# EAGLE design OperantFEDv5 (EAGLE 7.7.0)
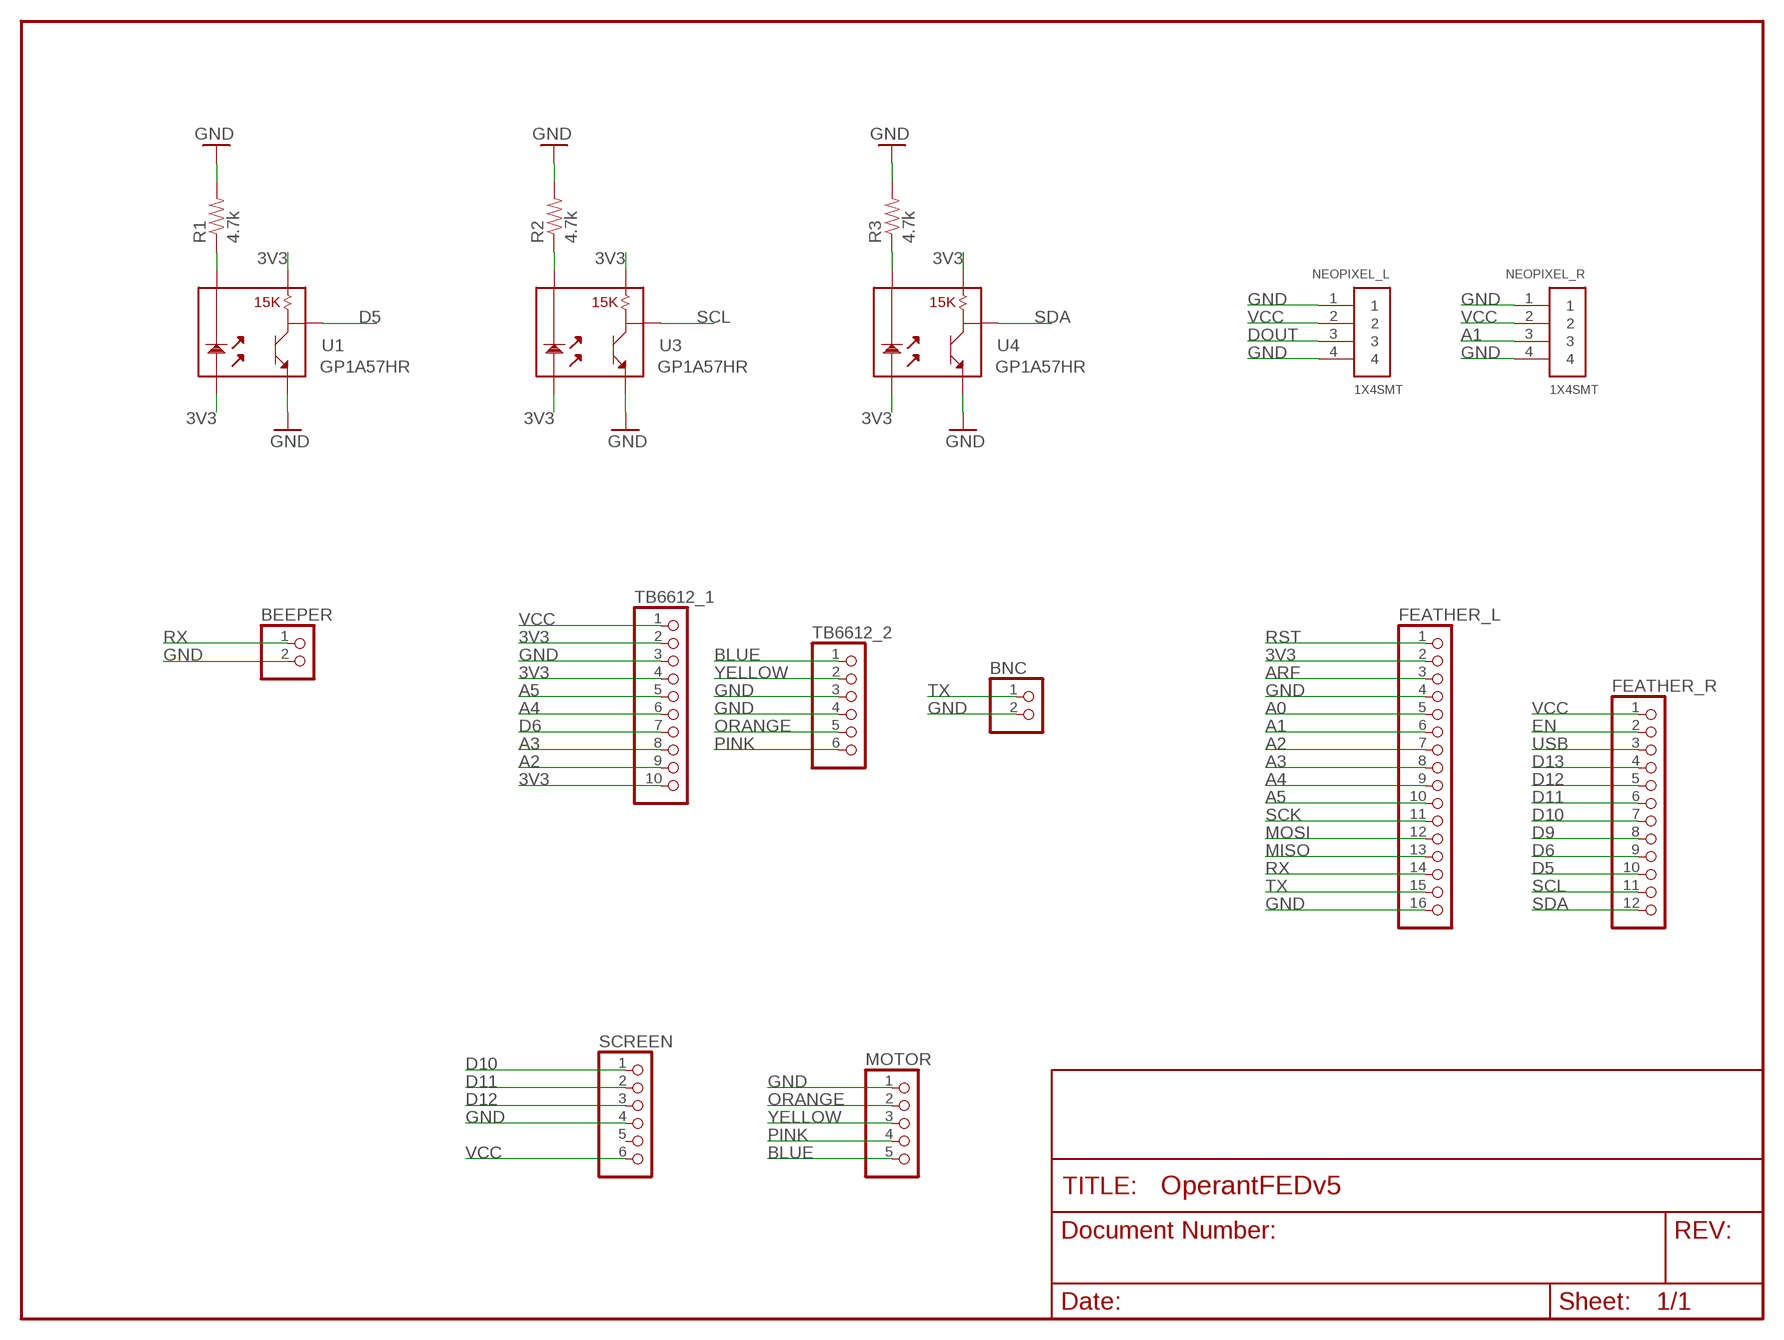
[diagram p0: schematic, sheet 1]

## Parts
BEEPER  PINHD-1X2  [1X02]
BNC  PINHD-1X2  [1X02]
FEATHER_L  PINHD-1X16  [1X16]
FEATHER_R  PINHD-1X12  [1X12]
MOTOR  PINHD-1X5  [1X05]
NEOPIXEL_L  1X4SMT  [1X4-SMT]
NEOPIXEL_R  1X4SMT  [1X4-SMT]
R1  4.7k  RESISTORPTH1  [AXIAL-0.3]
R2  4.7k  RESISTORPTH1  [AXIAL-0.3]
R3  4.7k  RESISTORPTH1  [AXIAL-0.3]
SCREEN  PINHD-1X6  [1X06]
TB6612_1  PINHD-1X10  [1X10]
TB6612_2  PINHD-1X6  [1X06]
U1  GP1A57HR  [GP1A57HR]
U3  GP1A57HR  [GP1A57HR]
U4  GP1A57HR  [GP1A57HR]

## Nets
3V3: FEATHER_L.2 TB6612_1.2 TB6612_1.4 TB6612_1.10 U1.1 U1.3 U3.1 U3.3 U4.1 U4.3
A0: FEATHER_L.5
A1: FEATHER_L.6 NEOPIXEL_R.3
A2: FEATHER_L.7 TB6612_1.9
A3: FEATHER_L.8 TB6612_1.8
A4: FEATHER_L.9 TB6612_1.6
A5: FEATHER_L.10 TB6612_1.5
ARF: FEATHER_L.3
BLUE: MOTOR.5 TB6612_2.1
D5: FEATHER_R.10 U1.4
D6: FEATHER_R.9 TB6612_1.7
D9: FEATHER_R.8
D10: FEATHER_R.7 SCREEN.1
D11: FEATHER_R.6 SCREEN.2
D12: FEATHER_R.5 SCREEN.3
D13: FEATHER_R.4
DOUT: NEOPIXEL_L.3
EN: FEATHER_R.2
GND: BEEPER.2 BNC.2 FEATHER_L.4 FEATHER_L.16 MOTOR.1 NEOPIXEL_L.1 NEOPIXEL_L.4 NEOPIXEL_R.1 NEOPIXEL_R.4 R1.P$2 R2.P$2 R3.P$2 SCREEN.4 TB6612_1.3 TB6612_2.3 TB6612_2.4 U1.5 U3.5 U4.5
MISO: FEATHER_L.13
MOSI: FEATHER_L.12
N$1: R2.P$1 U3.2
N$2: R1.P$1 U1.2
N$3: R3.P$1 U4.2
ORANGE: MOTOR.2 TB6612_2.5
PINK: MOTOR.4 TB6612_2.6
RST: FEATHER_L.1
RX: BEEPER.1 FEATHER_L.14
SCK: FEATHER_L.11
SCL: FEATHER_R.11 U3.4
SDA: FEATHER_R.12 U4.4
TX: BNC.1 FEATHER_L.15
USB: FEATHER_R.3
VCC: FEATHER_R.1 NEOPIXEL_L.2 NEOPIXEL_R.2 SCREEN.6 TB6612_1.1
YELLOW: MOTOR.3 TB6612_2.2
Unconnected: SCREEN.5

## Library data of the parts
BEEPER BNC = pinhead:PINHD-1X2: PIN HEADER
FEATHER_L = pinhead:PINHD-1X16: PIN HEADER
FEATHER_R = pinhead:PINHD-1X12: PIN HEADER
MOTOR = pinhead:PINHD-1X5: PIN HEADER
NEOPIXEL_L NEOPIXEL_R = adafruit:1X4: 4-pin connector
R1-R3 = SparkFun:RESISTOR: Resistor Basic schematic elements and footprints for 0603, 1206, and PTH 1/10th watt (small) resistors.
SCREEN TB6612_2 = pinhead:PINHD-1X6: PIN HEADER
TB6612_1 = pinhead:PINHD-1X10: PIN HEADER
U1 U3 U4 = SparkFun:GP1A57HR

## Board
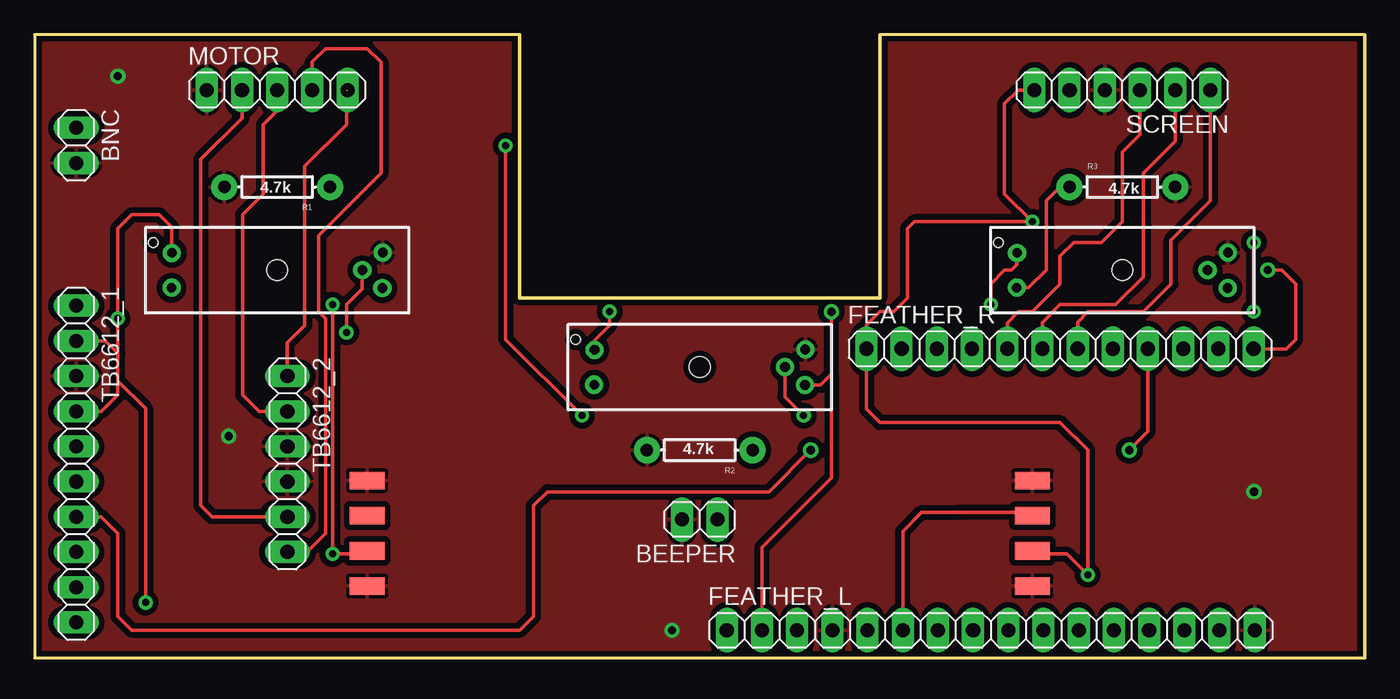
[diagram p1: board, top side]
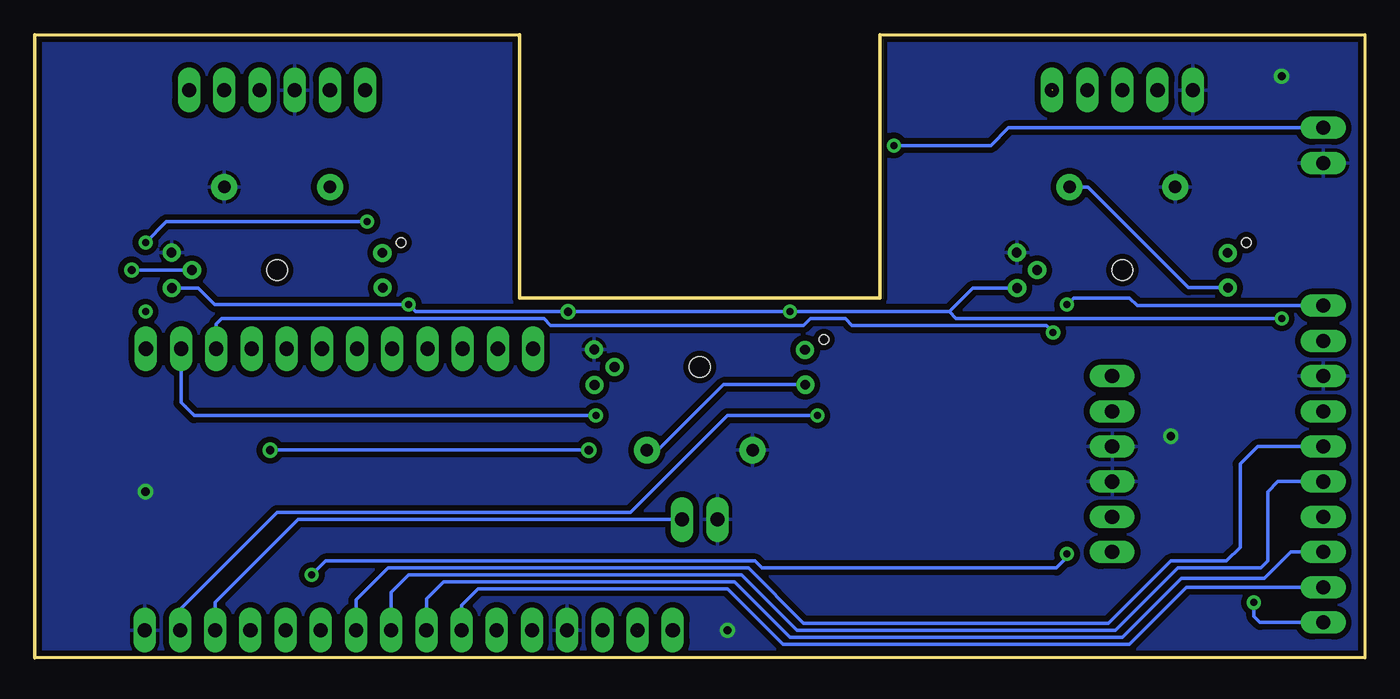
[diagram p2: board, bottom side, seen from below]

Size 96 x 45 mm. Coordinates in mm from the lower left corner, seen from the top.
Outline: 0,0 96,0 96,45 61,45 61,26 35,26 35,45 0,45 0,0
Copper layers (1*16): Top 0.0356mm / dielectric 1.5011mm / Bottom 0.0356mm
Design rules "default": minimum track width 8mil, minimum drill 20mil, track to track 8mil, track to pad 8mil, pad to pad 8mil, via to via 8mil, smd to smd 8mil, copper to edge 10mil, drill to drill 8mil, minimum pad ring 12mil, minimum via ring 10mil, stop-mask expansion 4mil, vias tented up to drill 20mil, thermal gap 10mil

### Footprints (pad centres in the part's own frame; a part is rotated, then mirrored left to right if it is on the bottom)
1X02 = drill 1.016 long: 1 -1.27,0; 2 1.27,0
1X16 = drill 1.016 long: 1 -19.05,0; 2 -16.51,0; 3 -13.97,0; 4 -11.43,0; 5 -8.89,0; 6 -6.35,0; 7 -3.81,0; 8 -1.27,0; 9 1.27,0; 10 3.81,0; 11 6.35,0; 12 8.89,0; 13 11.43,0; 14 13.97,0; 15 16.51,0; 16 19.05,0
1X12 = drill 1.016 long: 1 -13.97,0; 2 -11.43,0; 3 -8.89,0; 4 -6.35,0; 5 -3.81,0; 6 -1.27,0; 7 1.27,0; 8 3.81,0; 9 6.35,0; 10 8.89,0; 11 11.43,0; 12 13.97,0
1X05 = drill 1.016 long: 1 -5.08,0; 2 -2.54,0; 3 0,0; 4 2.54,0; 5 5.08,0
1X4-SMT = smd 1.27 x 2.54: 1 -3.81,0; 2 -1.27,0; 3 1.27,0; 4 3.81,0
AXIAL-0.3 = drill 0.9 pad 1.88: P$1 -3.81,0; P$2 3.81,0
1X06 = drill 1.016 long: 1 -6.35,0; 2 -3.81,0; 3 -1.27,0; 4 1.27,0; 5 3.81,0; 6 6.35,0
1X10 = drill 1.016 long: 1 -11.43,0; 2 -8.89,0; 3 -6.35,0; 4 -3.81,0; 5 -1.27,0; 6 1.27,0; 7 3.81,0; 8 6.35,0; 9 8.89,0; 10 11.43,0
GP1A57HR = drill 0.7: 1 -7.6,1.24; 2 -7.62,-1.27; 3 7.6,-1.3; 4 6.15,0; 5 7.62,1.27 | hole 1.5: 0,0 | hole 0.7: -8.95,2

### Placement (x,y rotation side)
BEEPER  48,10 180 top
BNC  3,37 270 top
FEATHER_L  69,2 0 top
FEATHER_R  74,22.32 0 top
MOTOR  17.5,41 0 top
NEOPIXEL_L  24,9 90 top
NEOPIXEL_R  72,9 90 top
R1  17.5,34 180 top
R2  48,15 180 top
R3  78.5,34 0 top
SCREEN  78.5,41 180 top
TB6612_1  3,14 270 top
TB6612_2  18.24,14 270 top
U1  17.5,28 0 top
U3  48,21 0 top
U4  78.5,28 0 top

### Tracks (layer width: path | path; a pad name or v marks a point on that pad's centre or on a via)
3V3  (via drill 0.51, 0.6 pad 0.61)  (1 unrouted)
  Top 0.254: 6,20 6,19 4.81,17.81 TB6612_1.4 | 6,20 6,22 | 6,22 v6,24.5 6,31 7,32 9,32 9.9,31.1 U1.1 | v41.5,25 41.5,24 40.4,22.9 U3.1 | 57.5,20.5 57.5,13 52.5,8 FEATHER_L.2 | v69,25.5 69,27 70,28 70.5,28 70.9,28.4 U4.1 | TB6612_1.2 5.11,22.89 6,22 | v8,4 8,18 6,20 | U3.3 56.7,19.7 57.5,20.5 | 57.5,20.5 v57.5,25
  Bottom 0.254: v6,24.5 29.5,24.5 30,25 | U4.3 84.2,26.7 83,25.5 v69,25.5 68.5,25 v57.5,25 v41.5,25 30,25 | U1.3 28.3,26.7 30,25 | TB6612_1.10 7.57,2.57 8,3 v8,4
A1
  Top 0.254: NEOPIXEL_R.3 72,10.5 67,10.5 66.5,10.5 64,10.5 62.65,9.15 FEATHER_L.6
A2
  Bottom 0.254: TB6612_1.9 12.89,5.11 17,1 42,1 46,5 64,5 65.19,3.81 FEATHER_L.7
A3
  Bottom 0.254: TB6612_1.8 5.35,7.65 7.25,5.75 13.25,5.75 17.5,1.5 41.5,1.5 45.5,5.5 66.5,5.5 67.73,4.27 FEATHER_L.8
A4
  Bottom 0.254: TB6612_1.6 6.27,12.73 7,12 7,7 7.5,6.5 13.5,6.5 18,2 41,2 45,6 69,6 70.27,4.73 FEATHER_L.9
A5
  Bottom 0.254: TB6612_1.5 7.73,15.27 9,14 9,8 10,7 14,7 18.5,2.5 40.5,2.5 44.5,6.5 70.5,6.5 72.81,4.19 FEATHER_L.10
BLUE  (1 unrouted)
  Top 0.254: TB6612_2.1 18.24,22.74 19.5,24 19.5,35.5 22.5,38.5 22.5,41
D5  (via drill 0.51)
  Top 0.254: U1.4 23.65,26.65 22.5,25.5 v22.5,23.5
  Bottom 0.254: v22.5,23.5 23,24 37,24 37.5,24.5 40,24.5 40.5,24 58.75,24 59.25,24.5 82.5,24.5 82.89,24.11 FEATHER_R.10
D6  (via drill 0.6)
  Top 0.254: TB6612_1.7 4.81,10.19 6,9 6,3 7,2 35,2 36,3 36,11 37,12 53,12 v56,15 | v79,15 80.35,16.35 FEATHER_R.9
  Bottom 0.254: v56,15 v79,15
D10
  Top 0.254: SCREEN.1 84.85,33 82,30.15 82,27 80,25 76,25 75.27,24.27 FEATHER_R.7
D11
  Top 0.254: SCREEN.2 82.31,37.31 80,35 80,27.5 78,25.5 74,25.5 72.73,24.23 FEATHER_R.6
D12
  Top 0.254: SCREEN.3 79.77,37.77 78.5,36.5 78.5,31.5 77,30 75,30 74,29 74,27 72,25 71,25 70.19,24.19 FEATHER_R.5
GND  (via drill 0.6 pad 0.81)
  other vias: 88,12 46,2 14,16 6,42
  pour Top (isolate 0.406): 0,0 96,0 96,45 61,45 61,26 35,26 35,45 0,45
  pour Bottom (isolate 0.406): 0,45 0,0 96,0 96,45 61,45 61,26 35,26 35,45
N$1
  Bottom 0.254: R2.P$1 51,15 46.27,19.73 U3.2
N$2
  Bottom 0.254: R1.P$1 20,34 12.73,26.73 U1.2
N$3
  Top 0.254: R3.P$1 74,34 73,33 73,28 71.73,26.73 U4.2
ORANGE
  Top 0.254: MOTOR.2 14.96,38.96 12,36 12,11 12.81,10.19 TB6612_2.5
PINK
  Top 0.254: MOTOR.4 20.04,43.04 21,44 24,44 25,43 25,35 20.5,30.5 20.5,25 21,24.5 21,9 19.65,7.65 TB6612_2.6
RX
  Bottom 0.254: BEEPER.1 77,10 82.97,4.03 FEATHER_L.14
SCL  (via drill 0.51)
  Top 0.254: U3.4 54.15,18.85 v55.5,17.5
  Bottom 0.254: v55.5,17.5 84.5,17.5 85.43,18.43 FEATHER_R.11
SDA  (via drill 0.6 pad 0.61)
  Top 0.254: FEATHER_R.12 90.32,22.32 91,23 91,27 90,28 v89,28
  Bottom 0.254: U4.4 v89,28
TX  (via drill 0.51)
  Top 0.254: v39.5,17.5 34,23 v34,37
  Bottom 0.254: v39.5,17.5 46,17.5 53,10.5 78.5,10.5 85.5,3.5 FEATHER_L.15 | BNC.1 25.73,38.27 27,37 v34,37
VCC  (via drill 0.51)
  Top 0.254: v21.5,25.5 v21.5,7.5 23.5,7.5 NEOPIXEL_L.2 | NEOPIXEL_R.2 72.5,7.5 74.5,7.5 v76,6 76,15 74,17 61,17 60.03,17.97 FEATHER_R.1 60.03,24.03 61,25 62,25 63,26 63,31 63.5,31.5 v72,31.5 70,33.5 70,40 71,41 SCREEN.6 | v88,25 v88,30
  Bottom 0.254: v72,31.5 86.5,31.5 v88,30 | v76,6 75,7 44,7 43.5,6.5 22.25,6.5 21.5,7.25 v21.5,7.5 | TB6612_1.1 16.43,25.43 17,26 21,26 v21.5,25.5
YELLOW
  Top 0.254: MOTOR.3 17.5,39.5 16.5,38.5 16.5,33.5 15,32 15,19 16.19,17.81 TB6612_2.2